# Altium project ver2_15_07_2025.PrjPcb (part 1 of 2)
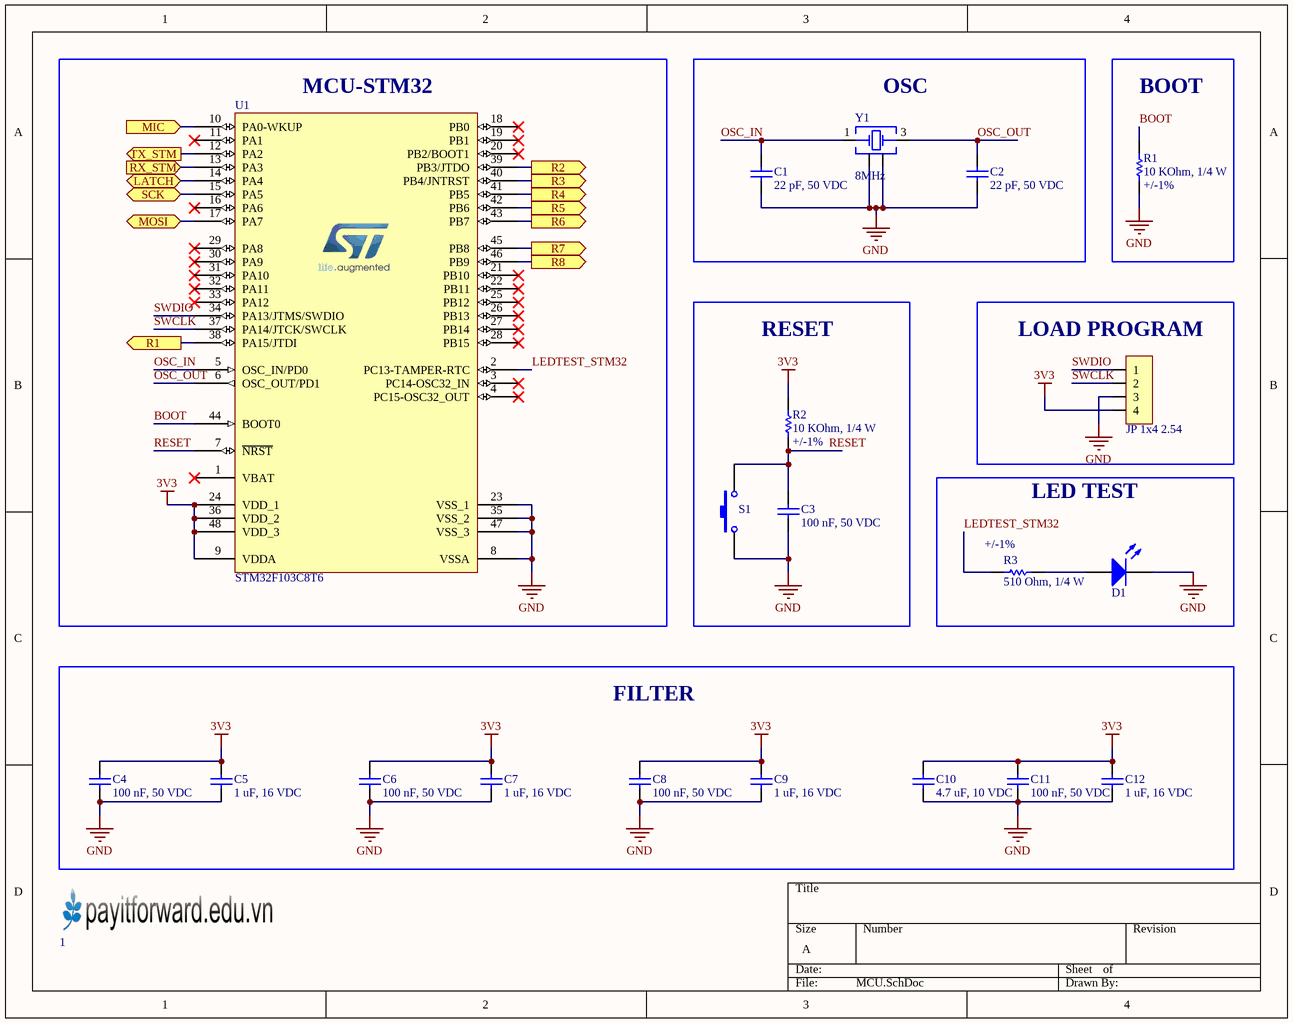
[diagram p0: MCU.SchDoc]
6 sheets, 190 parts. Net scope: flat (ports and power ports of the same name join across sheets).
Board file: ledcube_v2.PcbDoc
Sheets:
  MCU.SchDoc
  ESP32.SchDoc
  USB.SchDoc
  Output.SchDoc
  Input.SchDoc
  Power.SchDoc

## Sheet MCU.SchDoc
size A; SheetNumber: 1; SheetTotal: 6

### Parts
1  LOGO PIF  [PIF LOGO SMALL TOP]  (value not drawn)
C1  22 pF, 50 VDC  [CAP_0603]
C2  22 pF, 50 VDC  [CAP_0603]
C3  100 nF, 50 VDC  [CAP_0603]
C4  100 nF, 50 VDC  [CAP_0603]
C5  1 uF, 16 VDC  [CAP_0603]
C6  100 nF, 50 VDC  [CAP_0603]
C7  1 uF, 16 VDC  [CAP_0603]
C8  100 nF, 50 VDC  [CAP_0603]
C9  1 uF, 16 VDC  [CAP_0603]
C10  4.7 uF, 10 VDC  [CAP_0603]
C11  100 nF, 50 VDC  [CAP_0603]
C12  1 uF, 16 VDC  [CAP_0603]
D1  LED SMD  [LED_0805_Blue]  (value not drawn)
JP1  JP 1x4 2.54  [JP 1x4 DT]
R1  10 KOhm, 1/4 W  Resistance Tolerance: +/-1%  [resistor_0603]
R2  10 KOhm, 1/4 W  Resistance Tolerance: +/-1%  [resistor_0603]
R3  510 Ohm, 1/4 W  Resistance Tolerance: +/-1%  [resistor_0603]
S1  Tact SW - 2Pin  [SW-SMD]  (value not drawn)
U1  STM32F103C8T6  [STM32F103C8T6]
Y1  8MHz  [WE-XTAL_CFPX-180]

### Blocks framed on the sheet
MCU-STM32: U1
OSC: C1 C2 Y1
BOOT: R1
RESET: C3 R2 S1
LOAD PROGRAM: JP1
LED TEST: D1 R3
FILTER: C4-C12

### Ports
LATCH (bidir, see Output[2B], Output[2C], Output[5B], Output[5C]), MIC (in, see Input[3A]), MOSI (bidir, see Output[5B]), R1 (out, see Output[2B]), R2 (out, see Output[2B]), R3 (out, see Output[2B]), R4 (out, see Output[2C]), R5 (out, see Output[2C]), R6 (out, see Output[2C]), R7 (out, see Output[2C]), R8 (out, see Output[2D]), RX_STM (in, see ESP32[3B]), SCK (bidir, see Output[2B], Output[2C], Output[5B], Output[5C]), TX_STM (out, see ESP32[3B])

### Nets
3V3: C4.2 C5.2 C6.2 C7.2 C8.2 C9.2 C10.2 C11.2 C12.2 JP1.4 R2.2 U1.9(VDDA) U1.24(VDD_1) U1.36(VDD_2) U1.48(VDD_3)
GND: C1.1 C2.1 C3.1 C4.1 C5.1 C6.1 C7.1 C8.1 C9.1 C10.1 C11.1 C12.1 D1.2(K) JP1.3 R1.1 S1.1 U1.8(VSSA) U1.23(VSS_1) U1.35(VSS_2) U1.47(VSS_3) Y1.2(GND&Lid) Y1.4(GND&Lid)
BOOT: R1.2 U1.44(BOOT0)
LEDTEST_STM32: R3.1 U1.2(PC13-TAMPER-RTC)
OSC_IN: C1.2 U1.5(OSC_IN/PD0) Y1.1(Crystal)
OSC_OUT: C2.2 U1.6(OSC_OUT/PD1) Y1.3(Crystal)
RESET: C3.2 R2.1 S1.2 U1.7(~{NRST})
SWCLK: JP1.2 U1.37(PA14/JTCK/SWCLK)
SWDIO: JP1.1 U1.34(PA13/JTMS/SWDIO)
NetC28_2: U1.10(PA0-WKUP) ; port MIC
NetD1_1: D1.1(A) R3.2
NetR5_1: U1.13(PA3) ; port RX_STM
NetR6_1: U1.12(PA2) ; port TX_STM
NetR11_2: U1.38(PA15/JTDI) ; port R1
NetR28_2: U1.39(PB3/JTDO) ; port R2
NetR31_2: U1.40(PB4/JNTRST) ; port R3
NetR46_2: U1.41(PB5) ; port R4
NetR51_2: U1.42(PB6) ; port R5
NetR64_2: U1.43(PB7) ; port R6
NetR71_2: U1.45(PB8) ; port R7
NetR82_2: U1.46(PB9) ; port R8
NetU1_14: U1.14(PA4) ; port LATCH
NetU1_15: U1.15(PA5) ; port SCK
NetU1_17: U1.17(PA7) ; port MOSI

Not connected (* = marked no-connect by the designer): U1 1(VBAT)* 3(PC14-OSC32_IN)* 4(PC15-OSC32_OUT)* 11(PA1)* 16(PA6)* 18(PB0)* 19(PB1)* 20(PB2/BOOT1)* 21(PB10)* 22(PB11)* 25(PB12)* 26(PB13)* 27(PB14)* 28(PB15)* 29(PA8)* 30(PA9)* 31(PA10)* 32(PA11)* 33(PA12)*

### Library data of the parts
C1 C2 = 0106032200550: CAP, size 0603, 22 pF, 50 VDC; Manufacture Name: TDK; Manufacture SN: CGA3E2NP01H220J080AA; Capacitance: 22 pF; Tolerance: +/-5%; Voltage Rating DC: 50 VDC; ComponentLink2Description: Datasheet; ComponentLink2URL: https://product.tdk.com/system/files/dam/doc/product/capacitor/ceramic/mlcc/catalog/mlcc_automotive_hightemp_en.pdf?ref_disty=mouser; Operating Temperature: -55 to +125degC; Packaging: Tape and Reel; Mounting Technology: SMT; Size: 0603; Supplier 1 Name: Mouser; Supplier 1 SN: 810-CGA3E2NP01H220JA; Supplier 1 URL: https://www.mouser.com/ProductDetail/TDK/CGA3E2NP01H220J080AA?qs=xLDY6iXSiQbIDiPJq57tVA%3D%3D&utm_source=mouser-refine-download&utm_medium=file&utm_campaign=CGA3E2NP01H220J080AA&utm_content=TDK; Supplier 2 Name: Digi-Key; Supplier 2 SN: 445-12401-2-ND; Supplier 2 URL: https://www.digikey.com/en/products/detail/tdk-corporation/cga3e2np01h220j080aa/3949637; Supplier 3 Name: thegioiic; Supplier 3 SN: N/A; Supplier 3 URL: N/A; Value: 22 pF, 50 VDC
C3 C4 C6 C8 C11 = 0106031041050: CAP, size 0603, 100 nF, 50 VDC; Manufacture Name: TDK; Manufacture SN: CGA3E3X8R1H104K080AE; Capacitance: 100 nF; Tolerance: +/-10%; Voltage Rating DC: 50 VDC; ComponentLink2Description: Datasheet; ComponentLink2URL: https://product.tdk.com/system/files/dam/doc/product/capacitor/ceramic/mlcc/catalog/mlcc_automotive_soft_en.pdf?ref_disty=mouser; Operating Temperature: -55 to +125degC; Packaging: Tape and Reel; Mounting Technology: SMT; Size: 0603; Supplier 1 Name: Mouser; Supplier 1 SN: 810-CGA3E3X8R1H104KA; Supplier 1 URL: https://www.mouser.com/ProductDetail/TDK/CGA3E3X8R1H104K080AE?qs=nQSIdc08i%252Bd8g3IRRgU2bw%3D%3D&utm_source=mouser-refine-download&utm_medium=file&utm_campaign=CGA3E3X8R1H104K080AE&utm_content=TDK; Supplier 2 Name: Digi-Key; Supplier 2 SN: 445-173697-2-ND; Supplier 2 URL: https://www.digikey.com/en/products/detail/tdk-corporation/cga3e3x8r1h104k080ae/5809262; Supplier 3 Name: thegioiic; Supplier 3 SN: N/A; Supplier 3 URL: N/A; Value: 100 nF, 50 VDC
C5 C7 C9 C12 = 0106031051016: CAP, size 0603, 1 uF, 16 VDC; Manufacture Name: Samsung Electro-Mechanics; Manufacture SN: CL10B105KO8NNWC; Capacitance: 1 uF; Tolerance: +/-10%; Voltage Rating DC: 16 VDC; ComponentLink2Description: Datasheet; ComponentLink2URL: https://www.mouser.vn/datasheet/2/585/Samsung_MLCC_1837944-1929650.pdf; Operating Temperature: -55 to +125degC; Packaging: Tape and Reel; Mounting Technology: SMT; Size: 0603; Supplier 1 Name: Mouser; Supplier 1 SN: 187-CL10B105KO8NNWC; Supplier 1 URL: https://www.mouser.vn/ProductDetail/Samsung-Electro-Mechanics/CL10B105KO8NNWC?qs=81r%252BiQLm7BT%252BXtc72qn1ug%3D%3D&utm_source=mouser-refine-download&utm_medium=file&utm_campaign=CL10B105KO8NNWC&utm_content=Samsung-Electro-Mechanics; Supplier 2 Name: Digi-Key; Supplier 2 SN: 1276-CL10B105KO8NNWCTR-ND; Supplier 2 URL: https://www.digikey.com/en/products/detail/samsung-electro-mechanics/cl10b105ko8nnwc/16572783; Supplier 3 Name: thegioiic; Supplier 3 SN: N/A; Supplier 3 URL: https://www.thegioiic.com/tu-gom-0603-1uf-16v; Value: 1 uF, 16 VDC
C10 = 0106034751010: CAP, size 0603, 4.7 uF, 10 VDC; Manufacture Name: Samsung Electro-Mechanics; Manufacture SN: CL10A475KP8NNWC; Capacitance: 4.7 uF; Tolerance: +/-10%; Voltage Rating DC: 10 VDC; ComponentLink2Description: Datasheet; ComponentLink2URL: https://www.mouser.vn/datasheet/2/585/Samsung_MLCC_1837944-1929650.pdf; Operating Temperature: -55 to +125degC; Packaging: Tape and Reel; Mounting Technology: SMT; Size: 0603; Supplier 1 Name: Mouser; Supplier 1 SN: 187-CL10A475KP8NNWC; Supplier 1 URL: https://www.mouser.vn/ProductDetail/Samsung-Electro-Mechanics/CL10A475KP8NNWC?qs=81r%252BiQLm7BQyXBb52PEUBA%3D%3D&utm_source=mouser-refine-download&utm_medium=file&utm_campaign=CL10A475KP8NNWC&utm_content=Samsung-Electro-Mechanics; Supplier 2 Name: Digi-Key; Supplier 2 SN: 1276-CL10A475KP8NNWCTR-ND; Supplier 2 URL: https://www.digikey.com/en/products/detail/samsung-electro-mechanics/cl10a475kp8nnwc/16572736; Supplier 3 Name: thegioiic; Supplier 3 SN: N/A; Supplier 3 URL: https://www.thegioiic.com/tu-gom-0603-4-7uf-25v; Value: 4.7 uF, 10 VDC
D1 = LED SMD: LED
JP1 = JP 1x4 2.54 Duc Thang: Cắm; Ten_Linh_Kien: Jump Đơn Đực 2.54MM 1x40P Thẳng 11MM; Don_Vi: Con; Ma_Hang: MH000903; Ghi_Chu: *; Kieu_Chan: *; Chung_Loai: Cắm
R1 R2 = 0006031031: RES, size 0603, 10 KOhm, 1/4 W; Manufacture  Name: OEM; Resistance: 10 KOhm; Rated Power: 1/4 W; Size: 0603; Mounting Technology: SMT; Supplier 1 Name: Mouser; Supplier 1 SN: 755-ESR03EZPF1002; Supplier 2 Name: Digi-Key; Supplier 2 SN: RHM10KADTR-ND RHM10KADCT-ND RHM10KADDKR-ND; Supplier 1 URL: https://www.mouser.vn/ProductDetail/ROHM-Semiconductor/ESR03EZPF1002?qs=sGAEpiMZZMvdGkrng054t67Efho1F8r6CDeAsqwFse8%3D; Supplier 3 Name: thegioiic; Supplier 3 SN: N/A; Supplier 3 URL: N/A; Manufacture  SN: OEM; Value: 10 KOhm, 1/4 W; ComponentLink1Description: Datasheet link; ComponentLink1URL: https://fscdn.rohm.com/en/products/databook/datasheet/passive/resistor/chip_resistor/esr-e.pdf; ComponentLink2Description: Supplier 1 URL; ComponentLink2URL: N/A; ComponentLink3Description: Supplier 2 URL; ComponentLink3URL: https://www.digikey.com/en/products/detail/rohm-semiconductor/ESR03EZPF1002/1983429; ComponentLink4Description: Supplier 3 URL; ComponentLink4URL: N/A; Supplier 2 URL: https://www.digikey.com/en/products/detail/rohm-semiconductor/ESR03EZPF1002/1983429
R3 = 0006035111: RES, size 0603, 510 Ohm, 1/4 W; Manufacture  Name: OEM; Resistance: 510 Ohm; Rated Power: 1/4 W; Size: 0603; Mounting Technology: SMT; Supplier 1 Name: Mouser; Supplier 1 SN: 667-ERJ-UP3F5100V; Supplier 2 Name: Digi-Key; Supplier 2 SN: P17401TR-ND P17401CT-ND P17401DKR-ND; Supplier 1 URL: https://www.mouser.vn/ProductDetail/Panasonic/ERJ-UP3F5100V?qs=sGAEpiMZZMvdGkrng054twq3eZrCFN89dfK8VohwH1n5T5ZGAc92MQ%3D%3D; Supplier 3 Name: thegioiic; Supplier 3 SN: N/A; Supplier 3 URL: N/A; Manufacture  SN: OEM; Value: 510 Ohm, 1/4 W; ComponentLink1Description: Datasheet link; ComponentLink1URL: https://industrial.panasonic.com/cdbs/www-data/pdf/RDN0000/AOA0000C313.pdf; ComponentLink2Description: Supplier 1 URL; ComponentLink2URL: N/A; ComponentLink3Description: Supplier 2 URL; ComponentLink3URL: https://www.digikey.com/en/products/detail/panasonic-electronic-components/ERJ-3BQFR51V/5647434; ComponentLink4Description: Supplier 3 URL; ComponentLink4URL: N/A; Supplier 2 URL: https://www.digikey.com/en/products/detail/panasonic-electronic-components/ERJ-3BQFR51V/5647434
S1 = Tact SW - 2Pin: Switch button 2 pin
U1 = STM32F103C8T6: ARM Microcontrollers - MCU 32BIT Cortex M3 64KB 20KB RAM 2X12 ADC; Manufacturer: STM; Manufacture SN: STM32F103C8T6TR; Pad count: 48; ComponentLink1Description: Datasheet; Part Number: STM32F103C8T6; Value: STM32F103C8T6; ComponentLink1URL: https://www.mouser.com/datasheet/2/389/stm32f103c8-1851025.pdf; Footprint name: LQFP48; ComponentLink2Description: Supplier 1 URL; ComponentLink2URL: https://www.mouser.com/ProductDetail/STMicroelectronics/STM32F103C8T6?qs=bhCVus9SdFtq6kqxsU5%2FDA%3D%3D; ComponentLink3Description: Supplier 2 URL; ComponentLink3URL: 497-17666-2-ND; ComponentLink4Description: Supplier 3 URL; ComponentLink4URL: https://www.thegioiic.com/stm32f103c8t6-32-bit-arm-cortex-m3-microcontroller-72mhz-64kb-flash-48-lqfp; Supplier 1 Name: Mouser; Supplier 1 SN: 511-STM32F103C8T6; Supplier 1 URL: https://www.mouser.com/ProductDetail/STMicroelectronics/STM32F103C8T6?qs=bhCVus9SdFtq6kqxsU5%2FDA%3D%3D; Supplier 2 Name: Digi-Key; Supplier 2 SN: 497-17666-2-ND; Supplier 2 URL: https://www.digikey.com/en/products/detail/stmicroelectronics/stm32f103c8t6tr/2122442; Supplier 3 Name: thegioiic; Supplier 3 SN: STM32F103C8T6; Supplier 3 URL: https://www.thegioiic.com/stm32f103c8t6-32-bit-arm-cortex-m3-microcontroller-72mhz-64kb-flash-48-lqfp
Y1 = 830108313809: WE-XTAL Quartz Crystal, SMT, CFPX-180, 8MHz, +/-30ppm; Manufacturer: Wurth Elektronik; Frequency Stability: +/-50ppm; Load Capacitance: 12pF; ComponentLink1Description: Manufacturer; ComponentLink1URL: http://www.we-online.de; ComponentLink2Description: Datasheet; ComponentLink2URL: https://www.we-online.com/catalog/datasheet/830108313809.pdf; Operating Temperature: -40 to +85degC; Packaging: Tape and Reel; Manufacturer Part Number: 830108313809; Published Date: November 2020; Size: CFPX-180; Frequency: 8MHz; Frequency Tolerance: +/-30ppm; Mounting Technology: SMT

## Sheet ESP32.SchDoc
size A; SheetNumber: 2; SheetTotal: 6
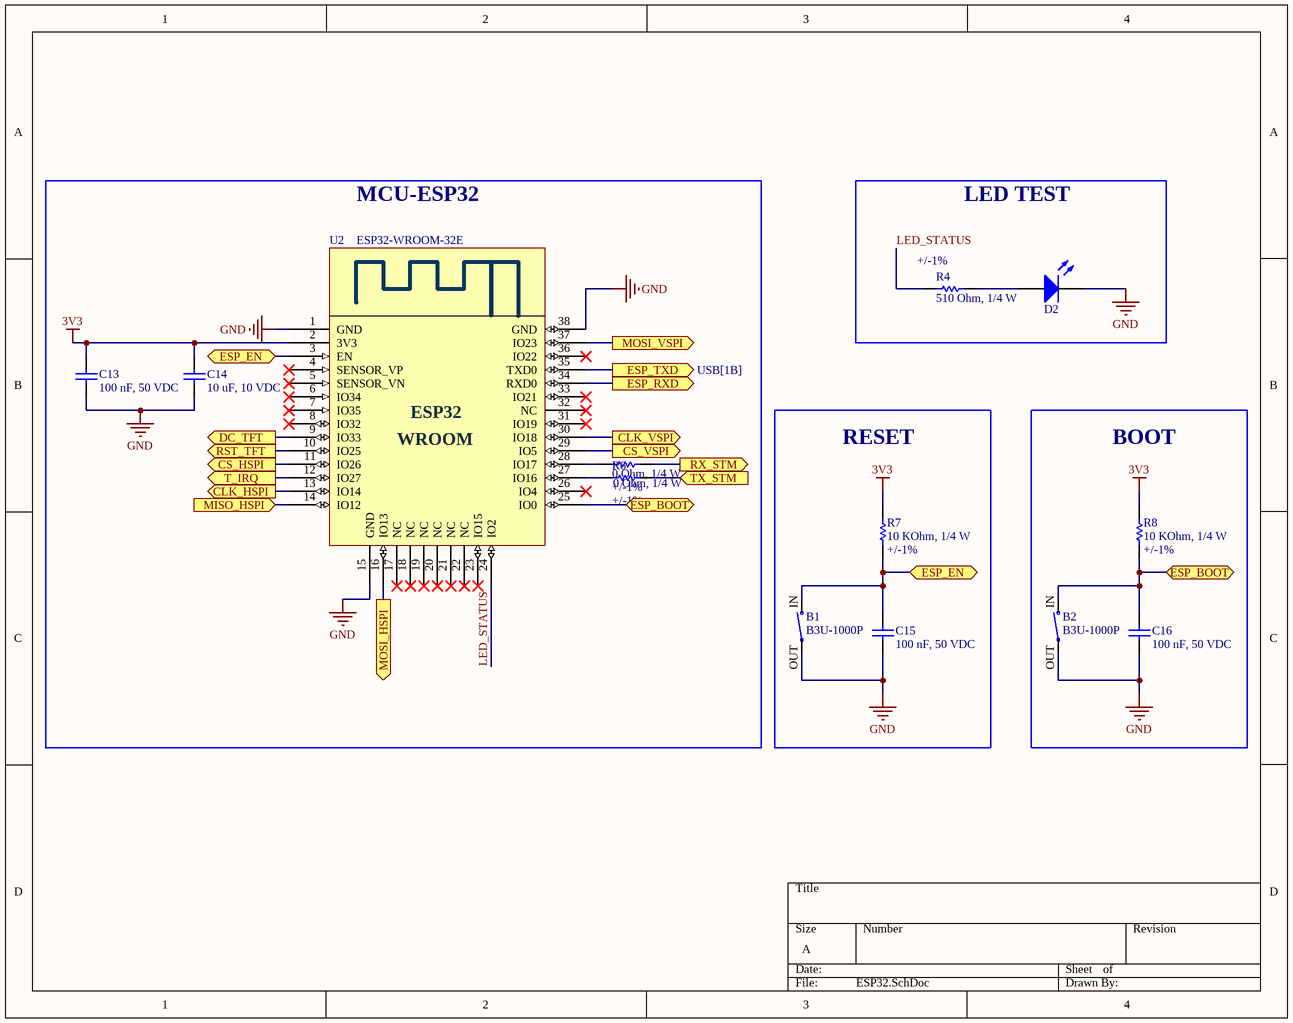
[diagram p1: ESP32.SchDoc]

### Parts
B1  B3U-1000P  [SODFL4025X160N]
B2  B3U-1000P  [SODFL4025X160N]
C13  100 nF, 50 VDC  [CAP_0603]
C14  10 uF, 10 VDC  [CAP_0603]
C15  100 nF, 50 VDC  [CAP_0603]
C16  100 nF, 50 VDC  [CAP_0603]
D2  LED SMD  [LED_0805_Blue]  (value not drawn)
R4  510 Ohm, 1/4 W  Resistance Tolerance: +/-1%  [resistor_0603]
R5  0 Ohm, 1/4 W  Resistance Tolerance: +/-1%  [resistor_0603]
R6  0 Ohm, 1/4 W  Resistance Tolerance: +/-1%  [resistor_0603]
R7  10 KOhm, 1/4 W  Resistance Tolerance: +/-1%  [resistor_0603]
R8  10 KOhm, 1/4 W  Resistance Tolerance: +/-1%  [resistor_0603]
U2  ESP32-WROOM-32E  [ESP32-WROOM]

### Blocks framed on the sheet
MCU-ESP32: C13 C14 R5 R6 U2
LED TEST: D2 R4
RESET: B1 C15 R7
BOOT: B2 C16 R8

### Ports
CLK_HSPI (out, see Input[4B]), CLK_VSPI (out, see Output[4A]), CS_HSPI (out, see Input[4B]), CS_VSPI (out, see Output[4A]), DC_TFT (out, see Output[4A]), ESP_BOOT (bidir, see ESP32[2B], USB[2D]), ESP_BOOT (bidir, see ESP32[4C], USB[2D]), ESP_EN (bidir, see ESP32[1B], USB[2C]), ESP_EN (bidir, see ESP32[3C], USB[2C]), ESP_RXD (out, see USB[1B]), ESP_TXD (out, see USB[1B]), MISO_HSPI (in, see Input[4B]), MOSI_HSPI (out, see Input[4B]), MOSI_VSPI (out, see Output[4A]), RST_TFT (out, see Output[4A]), RX_STM (out, see MCU[1A]), T_IRQ (out, see Input[4B]), TX_STM (in, see MCU[1A])

### Nets
3V3: C13.2 C14.2 R7.2 R8.2 U2.2(3V3)
GND: B1.OUT B2.OUT C13.1 C14.1 C15.1 C16.1 D2.2(K) U2.1(GND) U2.15(GND) U2.38(GND)
LED_STATUS: R4.1 U2.24(IO2)
NetB1_IN: B1.IN C15.2 R7.1 U2.3(EN) ; port ESP_EN
NetB2_IN: B2.IN C16.2 R8.1 U2.25(IO0) ; port ESP_BOOT
NetD2_1: D2.1(A) R4.2
NetJ2_2: U2.30(IO18) ; port CLK_VSPI
NetJ2_3: U2.37(IO23) ; port MOSI_VSPI
NetJ2_4: U2.9(IO33) ; port DC_TFT
NetJ2_5: U2.10(IO25) ; port RST_TFT
NetJ2_6: U2.29(IO5) ; port CS_VSPI
NetJ12_1: U2.12(IO27) ; port T_IRQ
NetJ12_2: U2.14(IO12) ; port MISO_HSPI
NetJ12_3: U2.16(IO13) ; port MOSI_HSPI
NetJ12_4: U2.11(IO26) ; port CS_HSPI
NetJ12_5: U2.13(IO14) ; port CLK_HSPI
NetR5_1: R5.1 ; port RX_STM
NetR5_2: R5.2 U2.28(IO17)
NetR6_1: R6.1 ; port TX_STM
NetR6_2: R6.2 U2.27(IO16)
NetU2_34: U2.34(RXD0) ; port ESP_RXD
NetU2_35: U2.35(TXD0) ; port ESP_TXD

Not connected (* = marked no-connect by the designer): U2 4(SENSOR_VP)* 5(SENSOR_VN)* 6(IO34)* 7(IO35)* 8(IO32)* 17(NC)* 18(NC)* 19(NC)* 20(NC)* 21(NC)* 22(NC)* 23(IO15)* 26(IO4)* 31(IO19)* 32(NC)* 33(IO21)* 36(IO22)*

### Notes on the sheet
- (in symbol ESP32-WROOM) WROOM

### Library data of the parts
B1 B2 = B3U-1000P: Switch Tactile N.O. SPST Round Button Gull Wing 0.05A 12VDC 1.5N SMD T/R; MF: Omron; MP: B3U1000P; SnapEDA_Link: https://www.snapeda.com/parts/B3U1000P/Omron/view-part/?ref=snap; Package: None; Value: *; Check_prices: https://www.snapeda.com/parts/B3U1000P/Omron/view-part/?ref=eda
C13 C15 C16 = 0106031041050: as C3 on sheet MCU; ComponentLink2Description: Datasheet; ComponentLink2URL: https://product.tdk.com/system/files/dam/doc/product/capacitor/ceramic/mlcc/catalog/mlcc_automotive_soft_en.pdf?ref_disty=mouser; Operating Temperature: -55 to +125degC; Packaging: Tape and Reel; Mounting Technology: SMT; Size: 0603; Supplier 1 Name: Mouser; Supplier 1 SN: 810-CGA3E3X8R1H104KA; Supplier 1 URL: https://www.mouser.com/ProductDetail/TDK/CGA3E3X8R1H104K080AE?qs=nQSIdc08i%252Bd8g3IRRgU2bw%3D%3D&utm_source=mouser-refine-download&utm_medium=file&utm_campaign=CGA3E3X8R1H104K080AE&utm_content=TDK; Supplier 2 Name: Digi-Key; Supplier 2 SN: 445-173697-2-ND; Supplier 2 URL: https://www.digikey.com/en/products/detail/tdk-corporation/cga3e3x8r1h104k080ae/5809262; Supplier 3 Name: thegioiic; Supplier 3 SN: N/A; Supplier 3 URL: N/A; Value: 100 nF, 50 VDC
C14 = 0106031061010: CAP, size 0603, 10 uF, 10 VDC; Manufacture Name: Samsung Electro-Mechanics; Manufacture SN: CL10A106KP8NNWC; Capacitance: 10 uF; Tolerance: +/-10%; Voltage Rating DC: 10 VDC; ComponentLink2Description: Datasheet; ComponentLink2URL: https://www.mouser.vn/datasheet/2/585/MLCC-1837944.pdf; Operating Temperature: -55 to +125degC; Packaging: Tape and Reel; Mounting Technology: SMT; Size: 0603; Supplier 1 Name: Mouser; Supplier 1 SN: 187-CL10A106KP8NNWC; Supplier 1 URL: https://www.mouser.vn/ProductDetail/Samsung-Electro-Mechanics/CL10A106KP8NNWC?qs=xZ%2FP%252Ba9zWqZx8LSX23YqWA%3D%3D&utm_source=mouser-refine-download&utm_medium=file&utm_campaign=CL10A106KP8NNWC&utm_content=Samsung-Electro-Mechanics; Supplier 2 Name: Digi-Key; Supplier 2 SN: 1276-CL10A106KP8NNWCTR-ND; Supplier 2 URL: https://www.digikey.com/en/products/detail/samsung-electro-mechanics/cl10a106kp8nnwc/16572907; Supplier 3 Name: thegioiic; Supplier 3 SN: N/A; Supplier 3 URL: https://www.thegioiic.com/tu-gom-0603-10uf-25v; Value: 10 uF, 10 VDC
D2 = LED SMD: LED
R4 = 0006035111: as R3 on sheet MCU; Size: 0603; Mounting Technology: SMT; Supplier 1 Name: Mouser; Supplier 1 SN: 667-ERJ-UP3F5100V; Supplier 2 Name: Digi-Key; Supplier 2 SN: P17401TR-ND P17401CT-ND P17401DKR-ND; Supplier 1 URL: https://www.mouser.vn/ProductDetail/Panasonic/ERJ-UP3F5100V?qs=sGAEpiMZZMvdGkrng054twq3eZrCFN89dfK8VohwH1n5T5ZGAc92MQ%3D%3D; Supplier 3 Name: thegioiic; Supplier 3 SN: N/A; Supplier 3 URL: N/A; Manufacture  SN: OEM; Value: 510 Ohm, 1/4 W; ComponentLink1Description: Datasheet link; ComponentLink1URL: https://industrial.panasonic.com/cdbs/www-data/pdf/RDN0000/AOA0000C313.pdf; ComponentLink2Description: Supplier 1 URL; ComponentLink2URL: N/A; ComponentLink3Description: Supplier 2 URL; ComponentLink3URL: https://www.digikey.com/en/products/detail/panasonic-electronic-components/ERJ-3BQFR51V/5647434; ComponentLink4Description: Supplier 3 URL; ComponentLink4URL: N/A; Supplier 2 URL: https://www.digikey.com/en/products/detail/panasonic-electronic-components/ERJ-3BQFR51V/5647434
R5 R6 = 0006030001: RES, size 0603, 0 Ohm, 1/4 W; Manufacture  Name: YAGEO; Manufacture  SN: AC0603FR-070RL; Resistance: 0 Ohm; Rated Power: 1/4 W; Size: 0603; Mounting Technology: SMT; Supplier 1 Name: Mouser; Supplier 1 SN: 603-AC0603FR-070RL; Supplier 2 Name: Digi-Key; Supplier 2 SN: 311-0.0LDTR-ND; Supplier 1 URL: https://www.mouser.com/ProductDetail/YAGEO/AC0603FR-070RL?qs=sGAEpiMZZMtlubZbdhIBIOG3KwTtqrl%2FD2D%252BGuMCfoY%3D; Supplier 3 Name: thegioiic; Supplier 3 SN: N/A; Supplier 3 URL: https://www.thegioiic.com/dien-tro-0-ohm-0603-1-; Value: 0 Ohm, 1/4 W; ComponentLink1Description: Datasheet link; ComponentLink1URL: https://www.mouser.com/datasheet/2/447/Yageo_06282023_ACseries-3224032.pdf; ComponentLink2Description: Supplier 1 URL; ComponentLink2URL: N/A; ComponentLink3Description: Supplier 2 URL; ComponentLink3URL: https://www.digikey.com/en/products/detail/yageo/ac0603fr-070rl/2827812; ComponentLink4Description: Supplier 3 URL; ComponentLink4URL: N/A; Supplier 2 URL: https://www.digikey.com/en/products/detail/yageo/ac0603fr-070rl/2827812
R7 R8 = 0006031031: as R1 on sheet MCU; Size: 0603; Mounting Technology: SMT; Supplier 1 Name: Mouser; Supplier 1 SN: 755-ESR03EZPF1002; Supplier 2 Name: Digi-Key; Supplier 2 SN: RHM10KADTR-ND RHM10KADCT-ND RHM10KADDKR-ND; Supplier 1 URL: https://www.mouser.vn/ProductDetail/ROHM-Semiconductor/ESR03EZPF1002?qs=sGAEpiMZZMvdGkrng054t67Efho1F8r6CDeAsqwFse8%3D; Supplier 3 Name: thegioiic; Supplier 3 SN: N/A; Supplier 3 URL: N/A; Manufacture  SN: OEM; Value: 10 KOhm, 1/4 W; ComponentLink1Description: Datasheet link; ComponentLink1URL: https://fscdn.rohm.com/en/products/databook/datasheet/passive/resistor/chip_resistor/esr-e.pdf; ComponentLink2Description: Supplier 1 URL; ComponentLink2URL: N/A; ComponentLink3Description: Supplier 2 URL; ComponentLink3URL: https://www.digikey.com/en/products/detail/rohm-semiconductor/ESR03EZPF1002/1983429; ComponentLink4Description: Supplier 3 URL; ComponentLink4URL: N/A; Supplier 2 URL: https://www.digikey.com/en/products/detail/rohm-semiconductor/ESR03EZPF1002/1983429
U2 = ESP32-WROOM: Bluetooth, WiFi 802.11b/g/n, Bluetooth v4.2 +EDR, Class 1, 2 and 3 Transceiver Module 2.4GHz ~ 2.5GHz Integrated, Trace Surface Mount; Mfr: Espressif Systems; Utilized IC / Part: ESP32-D0WD-V3; Modulation: CCK, DSSS, OFDM; Data Rate: 150Mbps; Power - Output: 20dBm; Sensitivity: -98dBm; Serial Interfaces: ADC, GPIO, I²C, I²S, PWM, SDIO, SPI, UART; Memory Size: 4MB Flash, 448kB ROM, 536kB SRAM; Voltage - Supply: 3V ~ 3.6V; Category: RF and Wireless; Series: ESP32; RF Family/Standard: Bluetooth, WiFi; Protocol: 802.11b/g/n, Bluetooth v4.2 +EDR, Class 1, 2 and 3; Frequency: 2.4GHz ~ 2.5GHz; Antenna Type: Integrated, Trace; Mounting Type: Surface Mount; ComponentLink1Description: Hshop; ComponentLink1URL: https://hshop.vn/products/mach-thu-phat-wifi-ble-soc-esp32-v1; Operating Temperature: -40°C ~ 85°C; ComponentLink2Description: Datasheet; ComponentLink2URL: https://www.espressif.com/sites/default/files/russianDocumentation/esp32-wroom-32e_esp32-wroom-32ue_datasheet_en.pdf

## Sheet USB.SchDoc
size A; SheetNumber: 3; SheetTotal: 6
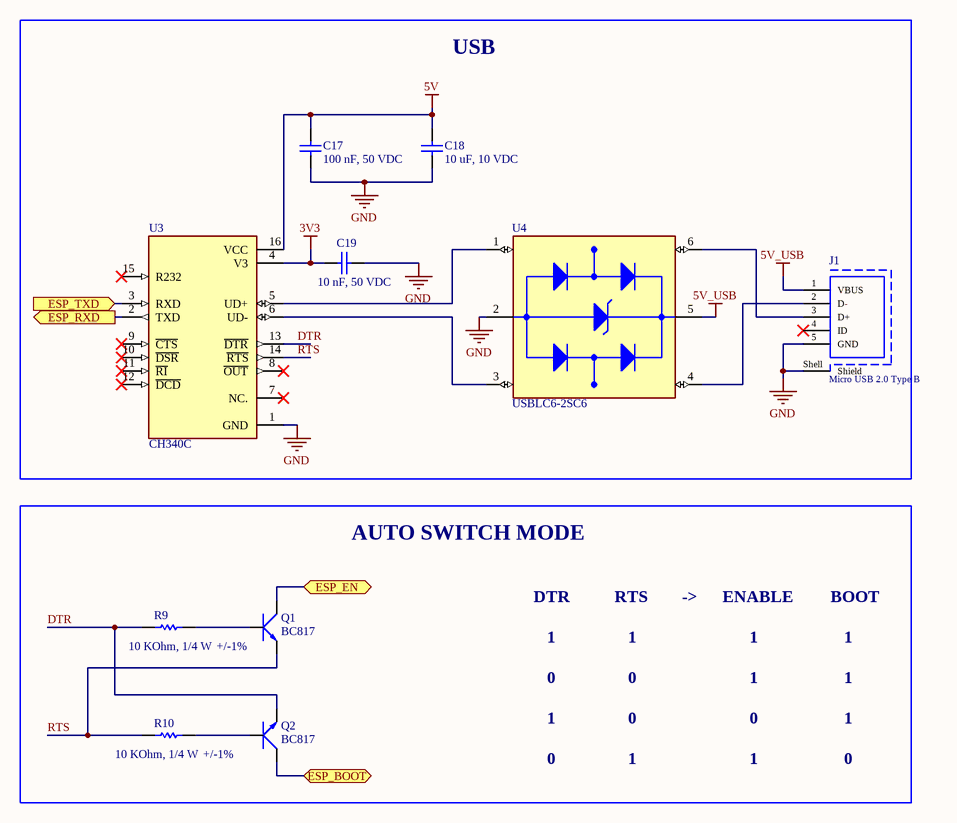
[diagram p2: USB.SchDoc]

### Parts
C17  100 nF, 50 VDC  [CAP_0603]
C18  10 uF, 10 VDC  [CAP_0603]
C19  10 nF, 50 VDC  [CAP_0603]
J1  Micro USB 2.0 Type B  [629105150521]
Q1  BC817  [SOT-23]
Q2  BC817  [SOT-23]
R9  10 KOhm, 1/4 W  Resistance Tolerance: +/-1%  [resistor_0603]
R10  10 KOhm, 1/4 W  Resistance Tolerance: +/-1%  [resistor_0603]
U3  CH340C  [SOIC127P600X180-16N]
U4  USBLC6-2SC6  [SOT95P280X145-6N]

### Blocks framed on the sheet
USB: C17-C19 J1 U3 U4
AUTO SWITCH MODE: Q1 Q2 R9 R10

### Ports
ESP_BOOT (bidir, see ESP32[2B], ESP32[4C]), ESP_EN (bidir, see ESP32[1B], ESP32[3C]), ESP_RXD (out, see ESP32[2B]), ESP_TXD (in, see ESP32[2B])

### Nets
3V3: C19.1 U3.4(V3)
5V: C17.2 C18.2 U3.16(VCC)
5V_USB: J1.1(VBUS) U4.5(VBUS)
GND: C17.1 C18.1 C19.2 J1.5(GND) J1.Shell(Shield) U3.1(GND) U4.2(GND)
DTR: Q2.2(E) R9.1 U3.13(~{DTR})
RTS: Q1.2(E) R10.1 U3.14(~{RTS})
NetB1_IN: Q1.3(C) ; port ESP_EN
NetB2_IN: Q2.3(C) ; port ESP_BOOT
NetJ1_2: J1.2(D-) U4.4(I/O2_OUT)
NetJ1_3: J1.3(D+) U4.6(I/O1_OUT)
NetQ1_1: Q1.1(B) R9.2
NetQ2_1: Q2.1(B) R10.2
NetU2_34: U3.2(TXD) ; port ESP_RXD
NetU2_35: U3.3(RXD) ; port ESP_TXD
NetU3_5: U3.5(UD+) U4.1(I/O1_IN)
NetU3_6: U3.6(UD-) U4.3(I/O2_IN)

Not connected (* = marked no-connect by the designer): J1 4(ID)*; U3 7(NC.)* 8(~{OUT})* 9(~{CTS})* 10(~{DSR})* 11(~{RI})* 12(~{DCD})* 15(R232)*

### Notes on the sheet
- DTR
- 1
- RTS
- ->
- ENABLE
- BOOT
- 0

### Library data of the parts
C17 = 0106031041050: as C3 on sheet MCU; ComponentLink2Description: Datasheet; ComponentLink2URL: https://product.tdk.com/system/files/dam/doc/product/capacitor/ceramic/mlcc/catalog/mlcc_automotive_soft_en.pdf?ref_disty=mouser; Operating Temperature: -55 to +125degC; Packaging: Tape and Reel; Mounting Technology: SMT; Size: 0603; Supplier 1 Name: Mouser; Supplier 1 SN: 810-CGA3E3X8R1H104KA; Supplier 1 URL: https://www.mouser.com/ProductDetail/TDK/CGA3E3X8R1H104K080AE?qs=nQSIdc08i%252Bd8g3IRRgU2bw%3D%3D&utm_source=mouser-refine-download&utm_medium=file&utm_campaign=CGA3E3X8R1H104K080AE&utm_content=TDK; Supplier 2 Name: Digi-Key; Supplier 2 SN: 445-173697-2-ND; Supplier 2 URL: https://www.digikey.com/en/products/detail/tdk-corporation/cga3e3x8r1h104k080ae/5809262; Supplier 3 Name: thegioiic; Supplier 3 SN: N/A; Supplier 3 URL: N/A; Value: 100 nF, 50 VDC
C18 = 0106031061010: as C14 on sheet ESP32; ComponentLink2Description: Datasheet; ComponentLink2URL: https://www.mouser.vn/datasheet/2/585/MLCC-1837944.pdf; Operating Temperature: -55 to +125degC; Packaging: Tape and Reel; Mounting Technology: SMT; Size: 0603; Supplier 1 Name: Mouser; Supplier 1 SN: 187-CL10A106KP8NNWC; Supplier 1 URL: https://www.mouser.vn/ProductDetail/Samsung-Electro-Mechanics/CL10A106KP8NNWC?qs=xZ%2FP%252Ba9zWqZx8LSX23YqWA%3D%3D&utm_source=mouser-refine-download&utm_medium=file&utm_campaign=CL10A106KP8NNWC&utm_content=Samsung-Electro-Mechanics; Supplier 2 Name: Digi-Key; Supplier 2 SN: 1276-CL10A106KP8NNWCTR-ND; Supplier 2 URL: https://www.digikey.com/en/products/detail/samsung-electro-mechanics/cl10a106kp8nnwc/16572907; Supplier 3 Name: thegioiic; Supplier 3 SN: N/A; Supplier 3 URL: https://www.thegioiic.com/tu-gom-0603-10uf-25v; Value: 10 uF, 10 VDC
C19 = 0106031031050: CAP, size 0603, 10 nF, 50 VDC; Manufacture Name: TDK; Manufacture SN: CGA3E2X8R1H103K080AA; Capacitance: 10 nF; Tolerance: +/-10%; Voltage Rating DC: 50 VDC; ComponentLink2Description: Datasheet; ComponentLink2URL: https://product.tdk.com/system/files/dam/doc/product/capacitor/ceramic/mlcc/catalog/mlcc_automotive_hightemp_en.pdf?ref_disty=mouser; Operating Temperature: -55 to +125degC; Packaging: Tape and Reel; Mounting Technology: SMT; Size: 0603; Supplier 1 Name: Mouser; Supplier 1 SN: 810-CGA3E2X8R1H103K; Supplier 1 URL: https://www.mouser.com/ProductDetail/TDK/CGA3E2X8R1H103K080AA?qs=NRhsANhppD89WrzFr8uamw%3D%3D&utm_source=mouser-refine-download&utm_medium=file&utm_campaign=CGA3E2X8R1H103K080AA&utm_content=TDK; Supplier 2 Name: Digi-Key; Supplier 2 SN: 445-5892-2-ND; Supplier 2 URL: https://www.digikey.com/en/products/detail/tdk-corporation/cga3e2x8r1h103k080aa/2443370; Supplier 3 Name: thegioiic; Supplier 3 SN: N/A; Supplier 3 URL: N/A; Value: 10 nF, 50 VDC
J1 = 629105150521: Micro USB 2.0 Type B Receptacle WR-COM, Horizontal, SMT, with Pegs, High Current at Pin 1 & Pin 5; Rated Current: 3 A; Contact Resistance: 30 mOhm; Working Voltage: 30 VAC; ComponentLink1Description: Datasheet; ComponentLink1URL: https://katalog.we-online.de/em/datasheet/629105150521.pdf; ComponentLink2Description: Supplier 1 URL; ComponentLink2URL: N/A; Part Number: 629105150521; Published Date: September 2018; Publisher: Wurth Elektronik; Orientation: Horizontal; Connector Type: Micro USB 2.0 Type B; Operating Temperature: -40 to 85 degC; Mounting Technology: SMT; Gender: Receptacle; Packaging: Tape and Reel; ComponentLink3Description: Supplier 2 URL; ComponentLink3URL: N/A; ComponentLink4Description: Supplier 3 URL; ComponentLink4URL: N/A; Supplier 1 Name: Mouser; Supplier 1 SN: 710-629105150521; Supplier 1 URL: https://www.mouser.vn/ProductDetail/Wurth-Elektronik/629105150521?qs=a9WhcLg8qCzXiH7kZP8GRQ%3D%3D; Supplier 2 Name: Digi-Key; Supplier 2 SN: N/A; Supplier 2 URL: N/A; Supplier 3 Name: thegioiic; Supplier 3 SN: N/A; Supplier 3 URL: N/A; Value: Micro USB 2.0 Type B
Q1 Q2 = Trans BC817: SOT-23 - C8658; Value: C9014
R9 R10 = 0006031031: as R1 on sheet MCU; Size: 0603; Mounting Technology: SMT; Supplier 1 Name: Mouser; Supplier 1 SN: 755-ESR03EZPF1002; Supplier 2 Name: Digi-Key; Supplier 2 SN: RHM10KADTR-ND RHM10KADCT-ND RHM10KADDKR-ND; Supplier 1 URL: https://www.mouser.vn/ProductDetail/ROHM-Semiconductor/ESR03EZPF1002?qs=sGAEpiMZZMvdGkrng054t67Efho1F8r6CDeAsqwFse8%3D; Supplier 3 Name: thegioiic; Supplier 3 SN: N/A; Supplier 3 URL: N/A; Manufacture  SN: OEM; Value: 10 KOhm, 1/4 W; ComponentLink1Description: Datasheet link; ComponentLink1URL: https://fscdn.rohm.com/en/products/databook/datasheet/passive/resistor/chip_resistor/esr-e.pdf; ComponentLink2Description: Supplier 1 URL; ComponentLink2URL: N/A; ComponentLink3Description: Supplier 2 URL; ComponentLink3URL: https://www.digikey.com/en/products/detail/rohm-semiconductor/ESR03EZPF1002/1983429; ComponentLink4Description: Supplier 3 URL; ComponentLink4URL: N/A; Supplier 2 URL: https://www.digikey.com/en/products/detail/rohm-semiconductor/ESR03EZPF1002/1983429
U3 = CH340C: USB to serial chip CH340; MF: WCH; Price: None; Availability: Not in stock; MP: CH340C; Package: None; SnapEDA_Link: https://www.snapeda.com/parts/CH340C/WCH/view-part/?ref=snap; Check_prices: https://www.snapeda.com/parts/CH340C/WCH/view-part/?ref=eda; Value: *
U4 = USBLC6-2SC6: 17V Clamp 5A (8/20Âµs) Ipp Tvs Diode Surface Mount SOT-23-6; MF: STMicroelectronics; Value: *; SnapEDA_Link: https://www.snapeda.com/parts/USBLC6-2SC6/STMicroelectronics/view-part/?ref=snap; Check_prices: https://www.snapeda.com/parts/USBLC6-2SC6/STMicroelectronics/view-part/?ref=eda; Purchase-URL: https://pricing.snapeda.com/search/part/USBLC6-2SC6/?ref=eda; Price: None; Availability: In Stock; Package: SOT-23-6 STMicroelectronics; MP: USBLC6-2SC6

## Sheet Output.SchDoc
size A2; SheetNumber: 4; SheetTotal: 6
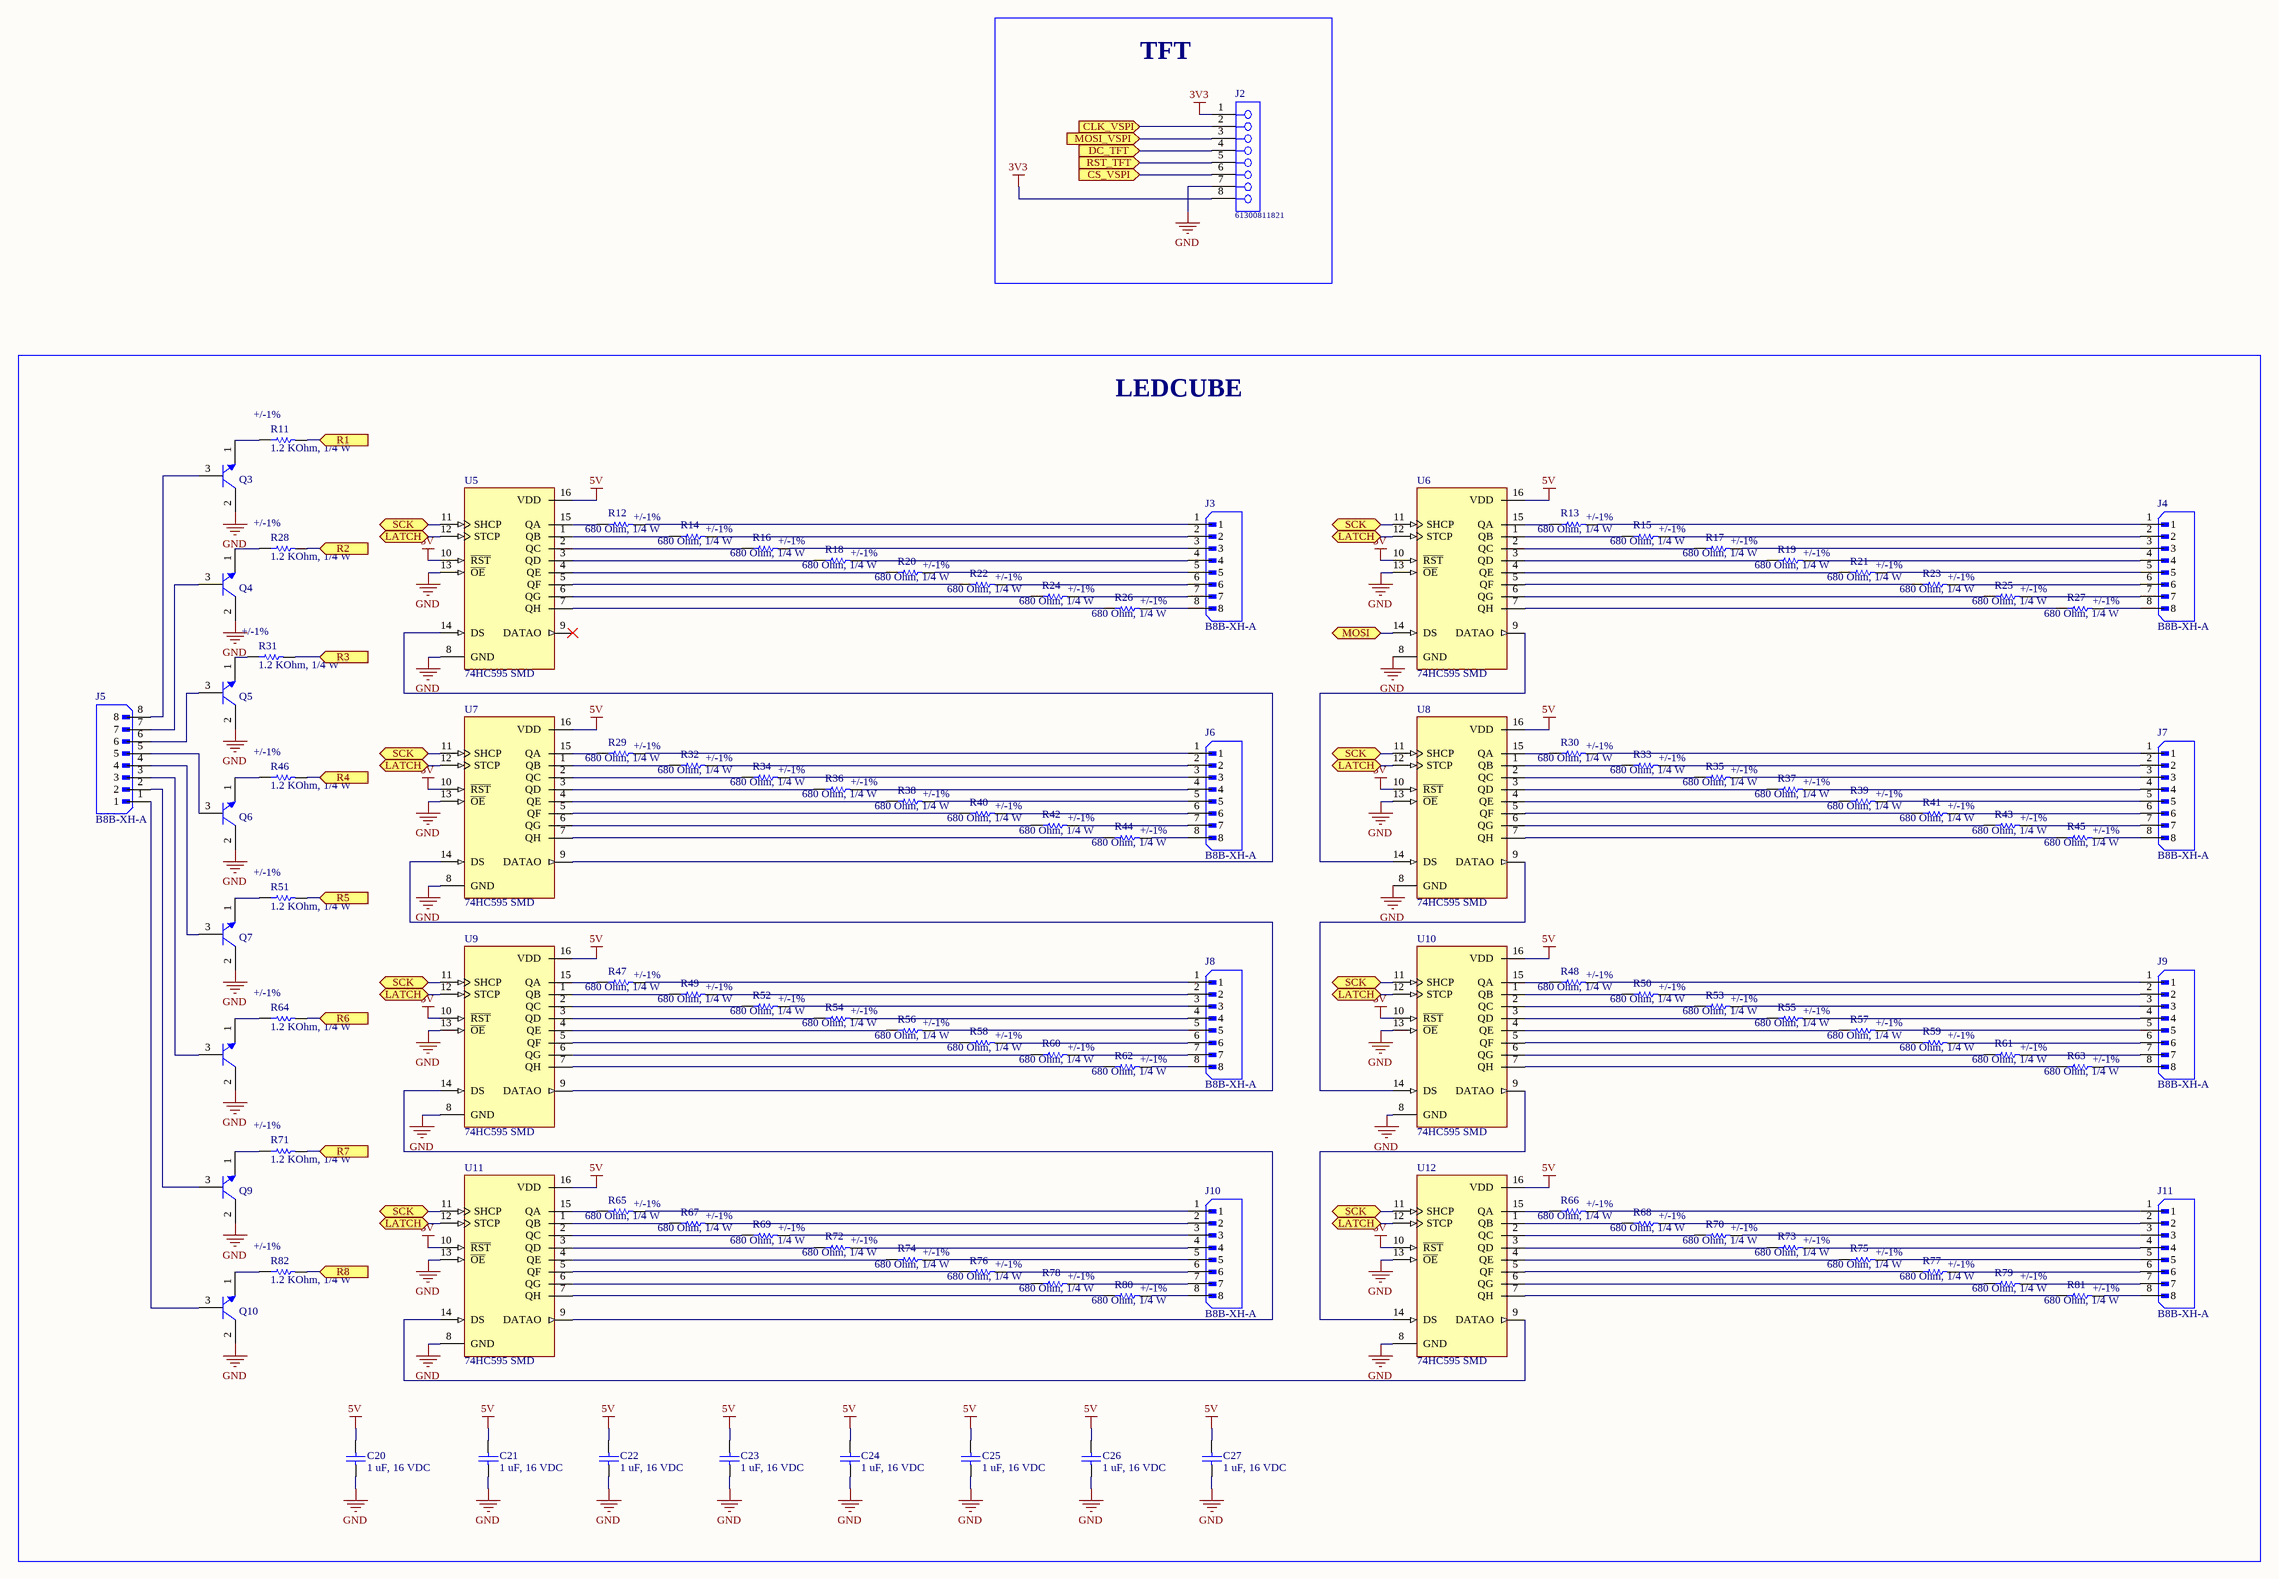
[diagram p3: Output.SchDoc]

### Parts
C20  1 uF, 16 VDC  [CAP_0603]
C21  1 uF, 16 VDC  [CAP_0603]
C22  1 uF, 16 VDC  [CAP_0603]
C23  1 uF, 16 VDC  [CAP_0603]
C24  1 uF, 16 VDC  [CAP_0603]
C25  1 uF, 16 VDC  [CAP_0603]
C26  1 uF, 16 VDC  [CAP_0603]
C27  1 uF, 16 VDC  [CAP_0603]
J2  61300811821  [61300811821]
J3  B8B-XH-A  [JST_B8B-XH-A]
J4  B8B-XH-A  [JST_B8B-XH-A]
J5  B8B-XH-A  [JST_B8B-XH-A]
J6  B8B-XH-A  [JST_B8B-XH-A]
J7  B8B-XH-A  [JST_B8B-XH-A]
J8  B8B-XH-A  [JST_B8B-XH-A]
J9  B8B-XH-A  [JST_B8B-XH-A]
J10  B8B-XH-A  [JST_B8B-XH-A]
J11  B8B-XH-A  [JST_B8B-XH-A]
Q3  C1815  [SOT23B]  (value not drawn)
Q4  C1815  [SOT23B]  (value not drawn)
Q5  C1815  [SOT23B]  (value not drawn)
Q6  C1815  [SOT23B]  (value not drawn)
Q7  C1815  [SOT23B]  (value not drawn)
Q9  C1815  [SOT23B]  (value not drawn)
Q10  C1815  [SOT23B]  (value not drawn)
R11  1.2 KOhm, 1/4 W  Resistance Tolerance: +/-1%  [resistor_0603]
R12  680 Ohm, 1/4 W  Resistance Tolerance: +/-1%  [resistor_0603]
R13  680 Ohm, 1/4 W  Resistance Tolerance: +/-1%  [resistor_0603]
R14  680 Ohm, 1/4 W  Resistance Tolerance: +/-1%  [resistor_0603]
R15  680 Ohm, 1/4 W  Resistance Tolerance: +/-1%  [resistor_0603]
R16  680 Ohm, 1/4 W  Resistance Tolerance: +/-1%  [resistor_0603]
R17  680 Ohm, 1/4 W  Resistance Tolerance: +/-1%  [resistor_0603]
R18  680 Ohm, 1/4 W  Resistance Tolerance: +/-1%  [resistor_0603]
R19  680 Ohm, 1/4 W  Resistance Tolerance: +/-1%  [resistor_0603]
R20  680 Ohm, 1/4 W  Resistance Tolerance: +/-1%  [resistor_0603]
R21  680 Ohm, 1/4 W  Resistance Tolerance: +/-1%  [resistor_0603]
R22  680 Ohm, 1/4 W  Resistance Tolerance: +/-1%  [resistor_0603]
R23  680 Ohm, 1/4 W  Resistance Tolerance: +/-1%  [resistor_0603]
R24  680 Ohm, 1/4 W  LATCH: +/-1%  [resistor_0603]
R25  680 Ohm, 1/4 W  Resistance Tolerance: +/-1%  [resistor_0603]
R26  680 Ohm, 1/4 W  Resistance Tolerance: +/-1%  [resistor_0603]
R27  680 Ohm, 1/4 W  Resistance Tolerance: +/-1%  [resistor_0603]
R28  1.2 KOhm, 1/4 W  Resistance Tolerance: +/-1%  [resistor_0603]
R29  680 Ohm, 1/4 W  Resistance Tolerance: +/-1%  [resistor_0603]
R30  680 Ohm, 1/4 W  Resistance Tolerance: +/-1%  [resistor_0603]
R31  1.2 KOhm, 1/4 W  Resistance Tolerance: +/-1%  [resistor_0603]
R32  680 Ohm, 1/4 W  Resistance Tolerance: +/-1%  [resistor_0603]
R33  680 Ohm, 1/4 W  Resistance Tolerance: +/-1%  [resistor_0603]
R34  680 Ohm, 1/4 W  Resistance Tolerance: +/-1%  [resistor_0603]
R35  680 Ohm, 1/4 W  Resistance Tolerance: +/-1%  [resistor_0603]
R36  680 Ohm, 1/4 W  Resistance Tolerance: +/-1%  [resistor_0603]
R37  680 Ohm, 1/4 W  Resistance Tolerance: +/-1%  [resistor_0603]
R38  680 Ohm, 1/4 W  Resistance Tolerance: +/-1%  [resistor_0603]
R39  680 Ohm, 1/4 W  Resistance Tolerance: +/-1%  [resistor_0603]
R40  680 Ohm, 1/4 W  Resistance Tolerance: +/-1%  [resistor_0603]
R41  680 Ohm, 1/4 W  Resistance Tolerance: +/-1%  [resistor_0603]
R42  680 Ohm, 1/4 W  Resistance Tolerance: +/-1%  [resistor_0603]
R43  680 Ohm, 1/4 W  Resistance Tolerance: +/-1%  [resistor_0603]
R44  680 Ohm, 1/4 W  Resistance Tolerance: +/-1%  [resistor_0603]
R45  680 Ohm, 1/4 W  Resistance Tolerance: +/-1%  [resistor_0603]
R46  1.2 KOhm, 1/4 W  Resistance Tolerance: +/-1%  [resistor_0603]
R47  680 Ohm, 1/4 W  Resistance Tolerance: +/-1%  [resistor_0603]
R48  680 Ohm, 1/4 W  Resistance Tolerance: +/-1%  [resistor_0603]
R49  680 Ohm, 1/4 W  Resistance Tolerance: +/-1%  [resistor_0603]
R50  680 Ohm, 1/4 W  Resistance Tolerance: +/-1%  [resistor_0603]
R51  1.2 KOhm, 1/4 W  Resistance Tolerance: +/-1%  [resistor_0603]
R52  680 Ohm, 1/4 W  Resistance Tolerance: +/-1%  [resistor_0603]
R53  680 Ohm, 1/4 W  Resistance Tolerance: +/-1%  [resistor_0603]
R54  680 Ohm, 1/4 W  Resistance Tolerance: +/-1%  [resistor_0603]
R55  680 Ohm, 1/4 W  Resistance Tolerance: +/-1%  [resistor_0603]
R56  680 Ohm, 1/4 W  Resistance Tolerance: +/-1%  [resistor_0603]
R57  680 Ohm, 1/4 W  Resistance Tolerance: +/-1%  [resistor_0603]
R58  680 Ohm, 1/4 W  Resistance Tolerance: +/-1%  [resistor_0603]
R59  680 Ohm, 1/4 W  Resistance Tolerance: +/-1%  [resistor_0603]
R60  680 Ohm, 1/4 W  Resistance Tolerance: +/-1%  [resistor_0603]
R61  680 Ohm, 1/4 W  Resistance Tolerance: +/-1%  [resistor_0603]
R62  680 Ohm, 1/4 W  Resistance Tolerance: +/-1%  [resistor_0603]
R63  680 Ohm, 1/4 W  Resistance Tolerance: +/-1%  [resistor_0603]
R64  1.2 KOhm, 1/4 W  Resistance Tolerance: +/-1%  [resistor_0603]
R65  680 Ohm, 1/4 W  Resistance Tolerance: +/-1%  [resistor_0603]
R66  680 Ohm, 1/4 W  Resistance Tolerance: +/-1%  [resistor_0603]
R67  680 Ohm, 1/4 W  Resistance Tolerance: +/-1%  [resistor_0603]
R68  680 Ohm, 1/4 W  Resistance Tolerance: +/-1%  [resistor_0603]
R69  680 Ohm, 1/4 W  Resistance Tolerance: +/-1%  [resistor_0603]
R70  680 Ohm, 1/4 W  Resistance Tolerance: +/-1%  [resistor_0603]
R71  1.2 KOhm, 1/4 W  Resistance Tolerance: +/-1%  [resistor_0603]
R72  680 Ohm, 1/4 W  Resistance Tolerance: +/-1%  [resistor_0603]
R73  680 Ohm, 1/4 W  Resistance Tolerance: +/-1%  [resistor_0603]
R74  680 Ohm, 1/4 W  Resistance Tolerance: +/-1%  [resistor_0603]
R75  680 Ohm, 1/4 W  Resistance Tolerance: +/-1%  [resistor_0603]
R76  680 Ohm, 1/4 W  Resistance Tolerance: +/-1%  [resistor_0603]
R77  680 Ohm, 1/4 W  Resistance Tolerance: +/-1%  [resistor_0603]
R78  680 Ohm, 1/4 W  Resistance Tolerance: +/-1%  [resistor_0603]
R79  680 Ohm, 1/4 W  Resistance Tolerance: +/-1%  [resistor_0603]
R80  680 Ohm, 1/4 W  Resistance Tolerance: +/-1%  [resistor_0603]
R81  680 Ohm, 1/4 W  Resistance Tolerance: +/-1%  [resistor_0603]
R82  1.2 KOhm, 1/4 W  Resistance Tolerance: +/-1%  [resistor_0603]
U5  74HC595 SMD  [SOP 16]
U6  74HC595 SMD  [SOP 16]
U7  74HC595 SMD  [SOP 16]
U8  74HC595 SMD  [SOP 16]
U9  74HC595 SMD  [SOP 16]
U10  74HC595 SMD  [SOP 16]
U11  74HC595 SMD  [SOP 16]
U12  74HC595 SMD  [SOP 16]
  C1815  [SOT23B]  (value not drawn)

### Blocks framed on the sheet
TFT: J2
LEDCUBE: C20-C27 J3-J11 Q3-Q7 Q9 Q10 R11-R82 U5-U12 

### Ports
CLK_VSPI (in, see ESP32[2B]), CS_VSPI (in, see ESP32[2B]), DC_TFT (in, see ESP32[1B]), LATCH (bidir, see MCU[1A], Output[2B], Output[2C], Output[5B], Output[5C]), MOSI (bidir, see MCU[1A]), MOSI_VSPI (in, see ESP32[2B]), R1 (in, see MCU[1B]), R2 (in, see MCU[2A]), R3 (in, see MCU[2A]), R4 (in, see MCU[2A]), R5 (in, see MCU[2A]), R6 (in, see MCU[2A]), R7 (in, see MCU[2A]), R8 (in, see MCU[2B]), RST_TFT (in, see ESP32[1B]), SCK (bidir, see MCU[1A], Output[2B], Output[2C], Output[5B], Output[5C])

### Nets
3V3: J2.1 J2.8
5V: C20.2 C21.2 C22.2 C23.2 C24.2 C25.2 C26.2 C27.2 U5.10(~{RST}) U5.16(VDD) U6.10(~{RST}) U6.16(VDD) U7.10(~{RST}) U7.16(VDD) U8.10(~{RST}) U8.16(VDD) U9.10(~{RST}) U9.16(VDD) U10.10(~{RST}) U10.16(VDD) U11.10(~{RST}) U11.16(VDD) U12.10(~{RST}) U12.16(VDD)
GND: C20.1 C21.1 C22.1 C23.1 C24.1 C25.1 C26.1 C27.1 J2.7 Q3.2(C) Q4.2(C) Q5.2(C) Q6.2(C) Q7.2(C) Q9.2(C) Q10.2(C) U5.8(GND) U5.13(~{OE}) U6.8(GND) U6.13(~{OE}) U7.8(GND) U7.13(~{OE}) U8.8(GND) U8.13(~{OE}) U9.8(GND) U9.13(~{OE}) U10.8(GND) U10.13(~{OE}) U11.8(GND) U11.13(~{OE}) U12.8(GND) U12.13(~{OE}) .2(C)
NetJ2_2: J2.2 ; port CLK_VSPI
NetJ2_3: J2.3 ; port MOSI_VSPI
NetJ2_4: J2.4 ; port DC_TFT
NetJ2_5: J2.5 ; port RST_TFT
NetJ2_6: J2.6 ; port CS_VSPI
NetJ3_1: J3.1 R12.2
NetJ3_2: J3.2 R14.2
NetJ3_3: J3.3 R16.2
NetJ3_4: J3.4 R18.2
NetJ3_5: J3.5 R20.2
NetJ3_6: J3.6 R22.2
NetJ3_7: J3.7 R24.2
NetJ3_8: J3.8 R26.2
NetJ4_1: J4.1 R13.2
NetJ4_2: J4.2 R15.2
NetJ4_3: J4.3 R17.2
NetJ4_4: J4.4 R19.2
NetJ4_5: J4.5 R21.2
NetJ4_6: J4.6 R23.2
NetJ4_7: J4.7 R25.2
NetJ4_8: J4.8 R27.2
NetJ5_1: J5.1 Q10.3(B)
NetJ5_2: J5.2 Q9.3(B)
NetJ5_3: J5.3 .3(B)
NetJ5_4: J5.4 Q7.3(B)
NetJ5_5: J5.5 Q6.3(B)
NetJ5_6: J5.6 Q5.3(B)
NetJ5_7: J5.7 Q4.3(B)
NetJ5_8: J5.8 Q3.3(B)
NetJ6_1: J6.1 R29.2
NetJ6_2: J6.2 R32.2
NetJ6_3: J6.3 R34.2
NetJ6_4: J6.4 R36.2
NetJ6_5: J6.5 R38.2
NetJ6_6: J6.6 R40.2
NetJ6_7: J6.7 R42.2
NetJ6_8: J6.8 R44.2
NetJ7_1: J7.1 R30.2
NetJ7_2: J7.2 R33.2
NetJ7_3: J7.3 R35.2
NetJ7_4: J7.4 R37.2
NetJ7_5: J7.5 R39.2
NetJ7_6: J7.6 R41.2
NetJ7_7: J7.7 R43.2
NetJ7_8: J7.8 R45.2
NetJ8_1: J8.1 R47.2
NetJ8_2: J8.2 R49.2
NetJ8_3: J8.3 R52.2
NetJ8_4: J8.4 R54.2
NetJ8_5: J8.5 R56.2
NetJ8_6: J8.6 R58.2
NetJ8_7: J8.7 R60.2
NetJ8_8: J8.8 R62.2
NetJ9_1: J9.1 R48.2
NetJ9_2: J9.2 R50.2
NetJ9_3: J9.3 R53.2
NetJ9_4: J9.4 R55.2
NetJ9_5: J9.5 R57.2
NetJ9_6: J9.6 R59.2
NetJ9_7: J9.7 R61.2
NetJ9_8: J9.8 R63.2
NetJ10_1: J10.1 R65.2
NetJ10_2: J10.2 R67.2
NetJ10_3: J10.3 R69.2
NetJ10_4: J10.4 R72.2
NetJ10_5: J10.5 R74.2
NetJ10_6: J10.6 R76.2
NetJ10_7: J10.7 R78.2
NetJ10_8: J10.8 R80.2
NetJ11_1: J11.1 R66.2
NetJ11_2: J11.2 R68.2
NetJ11_3: J11.3 R70.2
NetJ11_4: J11.4 R73.2
NetJ11_5: J11.5 R75.2
NetJ11_6: J11.6 R77.2
NetJ11_7: J11.7 R79.2
NetJ11_8: J11.8 R81.2
NetQ3_1: Q3.1(E) R11.1
NetQ4_1: Q4.1(E) R28.1
NetQ5_1: Q5.1(E) R31.1
NetQ6_1: Q6.1(E) R46.1
NetQ7_1: Q7.1(E) R51.1
NetQ9_1: Q9.1(E) R71.1
NetQ10_1: Q10.1(E) R82.1
NetR11_2: R11.2 ; port R1
NetR12_1: R12.1 U5.15(QA)
NetR13_1: R13.1 U6.15(QA)
NetR14_1: R14.1 U5.1(QB)
NetR15_1: R15.1 U6.1(QB)
NetR16_1: R16.1 U5.2(QC)
NetR17_1: R17.1 U6.2(QC)
NetR18_1: R18.1 U5.3(QD)
NetR19_1: R19.1 U6.3(QD)
NetR20_1: R20.1 U5.4(QE)
NetR21_1: R21.1 U6.4(QE)
NetR22_1: R22.1 U5.5(QF)
NetR23_1: R23.1 U6.5(QF)
NetR24_1: R24.1 U5.6(QG)
NetR25_1: R25.1 U6.6(QG)
NetR26_1: R26.1 U5.7(QH)
NetR27_1: R27.1 U6.7(QH)
NetR28_2: R28.2 ; port R2
NetR29_1: R29.1 U7.15(QA)
NetR30_1: R30.1 U8.15(QA)
NetR31_2: R31.2 ; port R3
NetR32_1: R32.1 U7.1(QB)
NetR33_1: R33.1 U8.1(QB)
NetR34_1: R34.1 U7.2(QC)
NetR35_1: R35.1 U8.2(QC)
NetR36_1: R36.1 U7.3(QD)
NetR37_1: R37.1 U8.3(QD)
NetR38_1: R38.1 U7.4(QE)
NetR39_1: R39.1 U8.4(QE)
NetR40_1: R40.1 U7.5(QF)
NetR41_1: R41.1 U8.5(QF)
NetR42_1: R42.1 U7.6(QG)
NetR43_1: R43.1 U8.6(QG)
NetR44_1: R44.1 U7.7(QH)
NetR45_1: R45.1 U8.7(QH)
NetR46_2: R46.2 ; port R4
NetR47_1: R47.1 U9.15(QA)
NetR48_1: R48.1 U10.15(QA)
NetR49_1: R49.1 U9.1(QB)
NetR50_1: R50.1 U10.1(QB)
NetR51_2: R51.2 ; port R5
NetR52_1: R52.1 U9.2(QC)
NetR53_1: R53.1 U10.2(QC)
NetR54_1: R54.1 U9.3(QD)
NetR55_1: R55.1 U10.3(QD)
NetR56_1: R56.1 U9.4(QE)
NetR57_1: R57.1 U10.4(QE)
NetR58_1: R58.1 U9.5(QF)
NetR59_1: R59.1 U10.5(QF)
NetR60_1: R60.1 U9.6(QG)
NetR61_1: R61.1 U10.6(QG)
NetR62_1: R62.1 U9.7(QH)
NetR63_1: R63.1 U10.7(QH)
NetR64_1: R64.1 .1(E)
NetR64_2: R64.2 ; port R6
NetR65_1: R65.1 U11.15(QA)
NetR66_1: R66.1 U12.15(QA)
NetR67_1: R67.1 U11.1(QB)
NetR68_1: R68.1 U12.1(QB)
NetR69_1: R69.1 U11.2(QC)
NetR70_1: R70.1 U12.2(QC)
NetR71_2: R71.2 ; port R7
NetR72_1: R72.1 U11.3(QD)
NetR73_1: R73.1 U12.3(QD)
NetR74_1: R74.1 U11.4(QE)
NetR75_1: R75.1 U12.4(QE)
NetR76_1: R76.1 U11.5(QF)
NetR77_1: R77.1 U12.5(QF)
NetR78_1: R78.1 U11.6(QG)
NetR79_1: R79.1 U12.6(QG)
NetR80_1: R80.1 U11.7(QH)
NetR81_1: R81.1 U12.7(QH)
NetR82_2: R82.2 ; port R8
NetU1_14: U5.12(STCP) U6.12(STCP) U7.12(STCP) U8.12(STCP) U9.12(STCP) U10.12(STCP) U11.12(STCP) U12.12(STCP) ; port LATCH
NetU1_15: U5.11(SHCP) U6.11(SHCP) U7.11(SHCP) U8.11(SHCP) U9.11(SHCP) U10.11(SHCP) U11.11(SHCP) U12.11(SHCP) ; port SCK
NetU1_17: U6.14(DS) ; port MOSI
NetU5_14: U5.14(DS) U7.9(DATAO)
NetU6_9: U6.9(DATAO) U8.14(DS)
NetU7_14: U7.14(DS) U9.9(DATAO)
NetU8_9: U8.9(DATAO) U10.14(DS)
NetU9_14: U9.14(DS) U11.9(DATAO)
NetU10_9: U10.9(DATAO) U12.14(DS)
NetU11_14: U11.14(DS) U12.9(DATAO)

Not connected (* = marked no-connect by the designer): U5 9(DATAO)*

### Library data of the parts
C20-C27 = 0106031051016: as C5 on sheet MCU; ComponentLink2Description: Datasheet; ComponentLink2URL: https://www.mouser.vn/datasheet/2/585/Samsung_MLCC_1837944-1929650.pdf; Operating Temperature: -55 to +125degC; Packaging: Tape and Reel; Mounting Technology: SMT; Size: 0603; Supplier 1 Name: Mouser; Supplier 1 SN: 187-CL10B105KO8NNWC; Supplier 1 URL: https://www.mouser.vn/ProductDetail/Samsung-Electro-Mechanics/CL10B105KO8NNWC?qs=81r%252BiQLm7BT%252BXtc72qn1ug%3D%3D&utm_source=mouser-refine-download&utm_medium=file&utm_campaign=CL10B105KO8NNWC&utm_content=Samsung-Electro-Mechanics; Supplier 2 Name: Digi-Key; Supplier 2 SN: 1276-CL10B105KO8NNWCTR-ND; Supplier 2 URL: https://www.digikey.com/en/products/detail/samsung-electro-mechanics/cl10b105ko8nnwc/16572783; Supplier 3 Name: thegioiic; Supplier 3 SN: N/A; Supplier 3 URL: https://www.thegioiic.com/tu-gom-0603-1uf-16v; Value: 1 uF, 16 VDC
J2 = 61300811821: WR-PHD Socket Header, THT, pitch 2.54mm, Single Row, Vertical, 8p; Manufacturer: Wurth Elektronik; Pin Number: 8; Rated Current: 3A; Working Voltage: 250VAC; Withstanding Voltage: 500VAC; Contact Resistance: 20mOhm; ComponentLink1Description: Manufacturer; ComponentLink1URL: http://www.we-online.de; ComponentLink2Description: Datasheet; ComponentLink2URL: https://www.we-online.com/catalog/datasheet/61300811821.pdf; Manufacturer Part Number: 61300811821; Published Date: May 2020; Pitch: 2.54mm; Operating Temperature: -40 to +125degC; Mounting Technology: THT; Packaging: Tray; Gender: Socket Header; Row Number: Single; Orientation: Vertical; ComponentLink3Description: Global Supply; ComponentLink3URL: https://www.we-online.com/en/components/products/PHD_2_54_SOCKET_HEADER_6130XX11821?sq=61300811821#61300811821; ComponentLink4Description: Global Supply; ComponentLink4URL: https://www.mouser.vn/ProductDetail/Wurth-Elektronik/61300811821?qs=ulEaXIWI0c%252BOxrSqc7jVmQ%3D%3D; ComponentLink5Description: Local Supply; ComponentLink5URL: https://www.thegioiic.com/hang-rao-cai-don-2-54mm-8-chan-1-hang-cao-11-8mm-xuyen-lo; Supplier 1 Name: Mouser; Supplier 1 SN: 710-61300811821; Supplier 1 URL: https://www.mouser.vn/ProductDetail/Wurth-Elektronik/61300811821?qs=ulEaXIWI0c%252BOxrSqc7jVmQ%3D%3D; Supplier 2 Name: Digi-Key; Supplier 2 SN: N/A; Supplier 2 URL: N/A; Supplier 3 Name: thegioiic; Supplier 3 SN: N/A; Supplier 3 URL: https://www.thegioiic.com/hang-rao-cai-don-2-54mm-8-chan-1-hang-cao-11-8mm-xuyen-lo
J3-J11 = B8B-XH-A: Connector Header Through Hole 8 position 0.098 (2.50mm); MF: JST; SnapEDA_Link: https://www.snapeda.com/parts/B8B-XH-A/JST/view-part/?ref=snap; Package: None; Value: *; MP: B8B-XH-A; Check_prices: https://www.snapeda.com/parts/B8B-XH-A/JST/view-part/?ref=eda
Q3-Q7 Q9 Q10  = C1815: NPN Bipolar Transistor
R11 R28 R31 R46 R51 R64 R71 R82 = 0006031221: RES, size 0603, 1.2 KOhm, 1/4 W; Manufacture  Name: OEM; Rated Power: 1/4 W; Resistance: 1.2 KOhm; Size: 0603; Mounting Technology: SMT; Supplier 1 Name: Mouser; Supplier 1 SN: 667-ERJ-UP3F1201V; Supplier 2 Name: Digi-Key; Supplier 2 SN: 10-ERJ-UP3F1201VTR-ND 10-ERJ-UP3F1201VCT-ND 10-ERJ-UP3F1201VDKR-ND; Supplier 1 URL: https://www.mouser.vn/ProductDetail/Panasonic/ERJ-UP3F1201V?qs=sGAEpiMZZMvdGkrng054twq3eZrCFN895BO3G72d%2F02jECAea43bgQ%3D%3D; Supplier 3 Name: thegioiic; Supplier 3 SN: N/A; Supplier 3 URL: N/A; Manufacture  SN: OEM; Value: 1.2 KOhm, 1/4 W; ComponentLink1Description: Datasheet link; ComponentLink1URL: https://api.pim.na.industrial.panasonic.com/file_stream/main/fileversion/4484; ComponentLink2Description: Supplier 1 URL; ComponentLink2URL: N/A; ComponentLink3Description: Supplier 2 URL; ComponentLink3URL: N/A; ComponentLink4Description: Supplier 3 URL; ComponentLink4URL: N/A; Supplier 2 URL: N/A
R12-R27 R29 R30 R32-R45 R47-R50 R52-R63 R65-R70 R72-R81 = 0006036811: RES, size 0603, 680 Ohm, 1/4 W; Manufacture  Name: OEM; Resistance: 680 Ohm; Rated Power: 1/4 W; Size: 0603; Mounting Technology: SMT; Supplier 1 Name: Mouser; Supplier 1 SN: 755-ESR03EZPF6800; Supplier 2 Name: Digi-Key; Supplier 2 SN: 511-ESR03EZPF6800TR-ND 511-ESR03EZPF6800CT-ND 511-ESR03EZPF6800DKR-ND; Supplier 1 URL: https://www.mouser.vn/ProductDetail/ROHM-Semiconductor/ESR03EZPF6800?qs=sGAEpiMZZMvdGkrng054tywGjayRHxH2%252BpGMJaiHRuJd8MneXKUC7g%3D%3D; Supplier 3 Name: thegioiic; Supplier 3 SN: N/A; Supplier 3 URL: N/A; Manufacture  SN: OEM; Value: 680 Ohm, 1/4 W; ComponentLink1Description: Datasheet link; ComponentLink1URL: https://fscdn.rohm.com/en/products/databook/datasheet/passive/resistor/chip_resistor/esr-e.pdf; ComponentLink2Description: Supplier 1 URL; ComponentLink2URL: N/A; ComponentLink3Description: Supplier 2 URL; ComponentLink3URL: https://www.digikey.com/en/products/detail/rohm-semiconductor/ESR03EZPF6800/4007267; ComponentLink4Description: Supplier 3 URL; ComponentLink4URL: N/A; Supplier 2 URL: https://www.digikey.com/en/products/detail/rohm-semiconductor/ESR03EZPF6800/4007267
U5-U12 = 74HC595 SMD: Dán; Ten_Linh_Kien: 74HC595D SOP16; Don_Vi: Con; Ma_Hang: MH000672; Ghi_Chu: *; Kieu_Chan: *; Chung_Loai: Dán